# Altium schematic sheet VGA_OUT.SCHDOC: VGA Ouput
size A4; DocumentNumber: 2; SheetNumber: 3; SheetTotal: 78; PageSetup: Record=PageOptions|CenterHorizontal=True|CenterVertical=True|PrintScale=0.97|XCorrection=1.00|YCorrection=1.00|PrintKind=1|BorderSize=5000000|LeftOffset=0|BottomOffset=0|Orientation=2|PaperLength=1000|PaperWidth=1000|Scale=100|PaperSource=7|PrintQuality=-4|MediaType=1|DitherType=10|PaperKind=A4 (210 x 297 mm)|PrintScaleMode=1
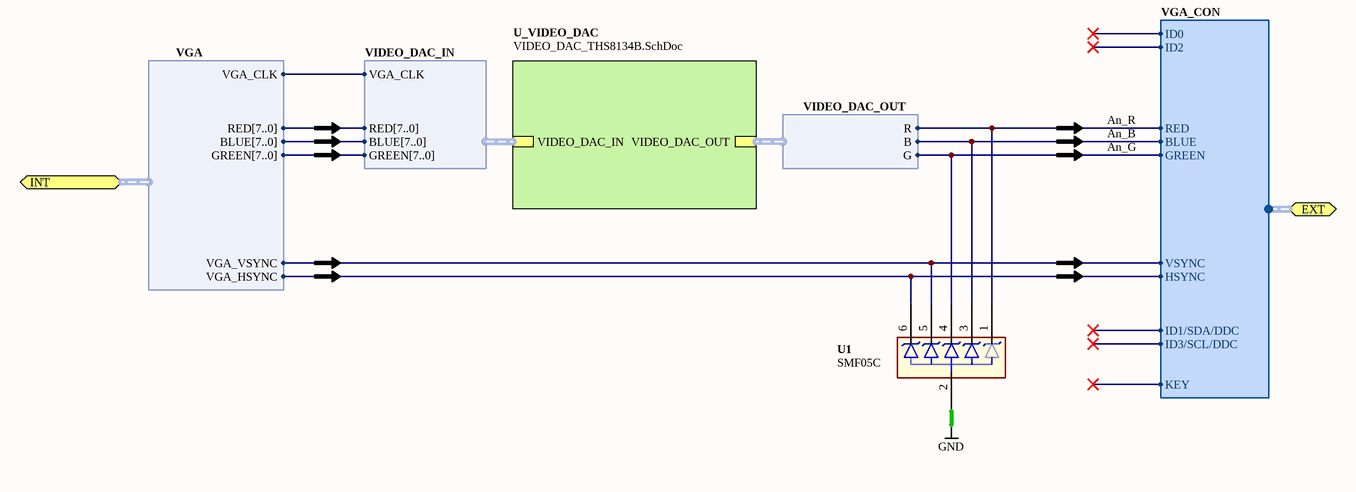
[diagram p0: VGA_OUT.SCHDOC]

## Parts
U1  SMF05C  [SC70_6L]

## Sub-sheets
U_VIDEO_DAC = VIDEO_DAC_THS8134B.SchDoc: VIDEO_DAC_OUT (harness VIDEO_DAC_OUT), VIDEO_DAC_IN (harness VIDEO_DAC_IN)

## Ports
EXT (harness VGA_CON), INT (harness VGA)

## Harnesses
VIDEO_DAC_IN: RED[7..0], GREEN[7..0], BLUE[7..0], VGA_CLK
VIDEO_DAC_OUT: B, R, G
VGA: RED[7..0], GREEN[7..0], BLUE[7..0], VGA_CLK, VGA_VSYNC, VGA_HSYNC
VGA_CON: RED, GREEN, BLUE, VSYNC, HSYNC, KEY, ID2, ID3/SCL/DDC, ID1/SDA/DDC, ID0

## Nets
GND: U1.2
An_B: U1.3 ; sheet U_VIDEO_DAC/VIDEO_DAC_OUT.B, port EXT.BLUE
An_G: U1.4 ; sheet U_VIDEO_DAC/VIDEO_DAC_OUT.G, port EXT.GREEN
An_R: U1.1 ; sheet U_VIDEO_DAC/VIDEO_DAC_OUT.R, port EXT.RED
NetU1_5: U1.5 ; port INT.VGA_VSYNC, port EXT.VSYNC
NetU1_6: U1.6 ; port INT.VGA_HSYNC, port EXT.HSYNC
(unnamed): sheet U_VIDEO_DAC/VIDEO_DAC_IN.VGA_CLK, port INT.VGA_CLK

## Notes on the sheet
- Sheet Title
- Project Title
- Size:
- Date:
- A4
- Assy:
- Time:
- Revision:
- Sheet
- of
- File:

## Library data of the parts
U1 = D-157-0000: TVS Diode Array  For ESD and Latch-Up Protection; Junction Capacitance: 130 pF; Peak Pulse Current: 8 A; Peak Pulse Power: 100 W; Reverse Breakdown Voltage: 6 V; Status: Unreleased; Category: Diode-Protection